# Altium schematic sheet MCU.SchDoc
size A4
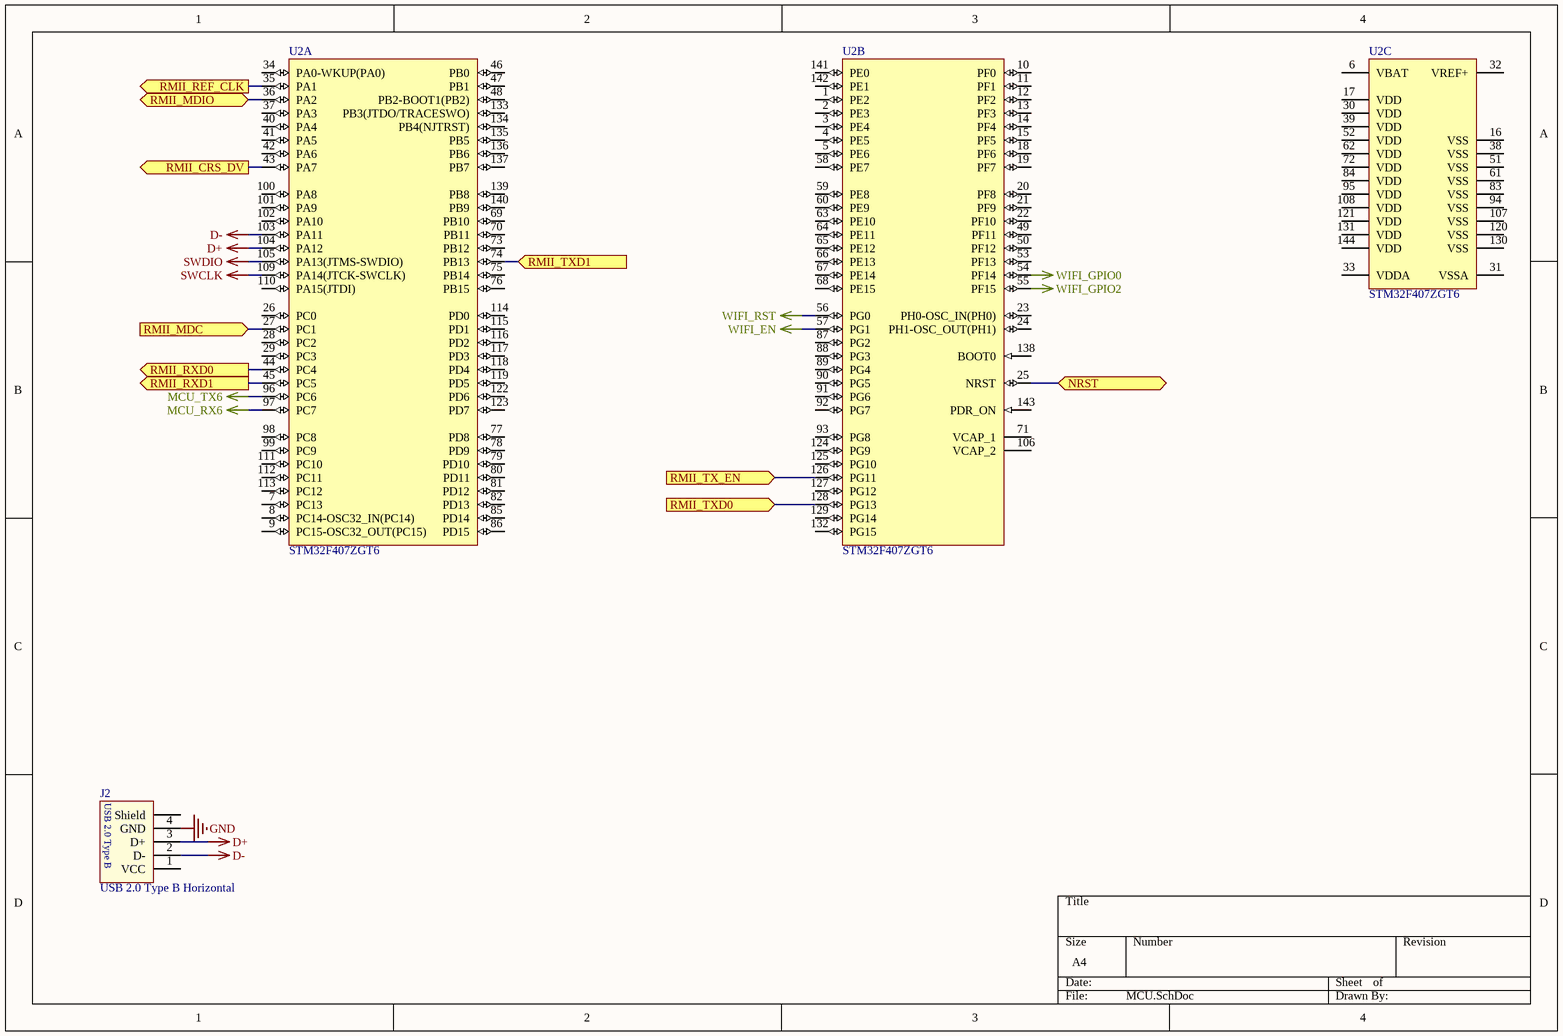
[diagram p0: MCU.SchDoc]

## Parts
J2  USB 2.0 Type B Horizontal  [61400416121]
U2  STM32F407ZGT6  [STM-LQFP144_N]  (parts A,B,C of 3)

## Ports
NRST, RMII_CRS_DV (out), RMII_MDC (in), RMII_MDIO (bidir), RMII_REF_CLK (out), RMII_RXD0 (out), RMII_RXD1 (out), RMII_TX_EN (in), RMII_TXD0 (in), RMII_TXD1 (in)

## Nets
D+: J2.3(D+) U2.104(PA12)
D-: J2.2(D-) U2.103(PA11)
GND: J2.4(GND)
MCU_RX6: U2.97(PC7)
MCU_TX6: U2.96(PC6)
SWCLK: U2.109(PA14(JTCK-SWCLK))
SWDIO: U2.105(PA13(JTMS-SWDIO))
WIFI_EN: U2.57(PG1)
WIFI_GPIO0: U2.54(PF14)
WIFI_GPIO2: U2.55(PF15)
WIFI_RST: U2.56(PG0)
NRST: U2.25(NRST) ; port NRST
RMII_CRS_DV: U2.43(PA7) ; port RMII_CRS_DV
RMII_MDC: U2.27(PC1) ; port RMII_MDC
RMII_MDIO: U2.36(PA2) ; port RMII_MDIO
RMII_REF_CLK: U2.35(PA1) ; port RMII_REF_CLK
RMII_RXD0: U2.44(PC4) ; port RMII_RXD0
RMII_RXD1: U2.45(PC5) ; port RMII_RXD1
RMII_TX_EN: U2.126(PG11) ; port RMII_TX_EN
RMII_TXD0: U2.128(PG13) ; port RMII_TXD0
RMII_TXD1: U2.74(PB13) ; port RMII_TXD1

Not connected (* = marked no-connect by the designer): J2 1(VCC) Shell(Shield); U2 1(PE2) 2(PE3) 3(PE4) 4(PE5) 5(PE6) 6(VBAT) 7(PC13) 8(PC14-OSC32_IN(PC14)) 9(PC15-OSC32_OUT(PC15)) 10(PF0) 11(PF1) 12(PF2) 13(PF3) 14(PF4) 15(PF5) 16(VSS) 17(VDD) 18(PF6) 19(PF7) 20(PF8) 21(PF9) 22(PF10) 23(PH0-OSC_IN(PH0)) 24(PH1-OSC_OUT(PH1)) 26(PC0) 28(PC2) 29(PC3) 30(VDD) 31(VSSA) 32(VREF+) 33(VDDA) 34(PA0-WKUP(PA0)) 37(PA3) 38(VSS) 39(VDD) 40(PA4) 41(PA5) 42(PA6) 46(PB0) 47(PB1) 48(PB2-BOOT1(PB2)) 49(PF11) 50(PF12) 51(VSS) 52(VDD) 53(PF13) 58(PE7) 59(PE8) 60(PE9) 61(VSS) 62(VDD) 63(PE10) 64(PE11) 65(PE12) 66(PE13) 67(PE14) 68(PE15) 69(PB10) 70(PB11) 71(VCAP_1) 72(VDD) 73(PB12) 75(PB14) 76(PB15) 77(PD8) 78(PD9) 79(PD10) 80(PD11) 81(PD12) 82(PD13) 83(VSS) 84(VDD) 85(PD14) 86(PD15) 87(PG2) 88(PG3) 89(PG4) 90(PG5) 91(PG6) 92(PG7) 93(PG8) 94(VSS) 95(VDD) 98(PC8) 99(PC9) 100(PA8) 101(PA9) 102(PA10) 106(VCAP_2) 107(VSS) 108(VDD) 110(PA15(JTDI)) 111(PC10) 112(PC11) 113(PC12) 114(PD0) 115(PD1) 116(PD2) 117(PD3) 118(PD4) 119(PD5) 120(VSS) 121(VDD) 122(PD6) 123(PD7) 124(PG9) 125(PG10) 127(PG12) 129(PG14) 130(VSS) 131(VDD) 132(PG15) 133(PB3(JTDO/TRACESWO)) 134(PB4(NJTRST)) 135(PB5) 136(PB6) 137(PB7) 138(BOOT0) 139(PB8) 140(PB9) 141(PE0) 142(PE1) 143(PDR_ON) 144(VDD)

## Notes on the sheet
- (in symbol USB 2.0 Type B Horizontal) USB 2.0 Type B

## Library data of the parts
J2 = USB 2.0 Type B Horizontal: USB 2.0 Type B Horizontal WR-COM; Interface Type: Type B; Sub-Family: USB 2.0; Gender: Receptacle; ComponentLink1Description: Manufacturer; ComponentLink1URL: http://www.we-online.de; ComponentLink2Description: Datasheet; ComponentLink2URL: http://katalog.we-online.de/em/datasheet/61400416121.pdf; Part Number: 61400416121; Published Date: April 2017; Publisher: Wurth Elektronik; Type: Horizontal; Construction: THT
U2 = STM32F407ZGT6: ARM Cortex-M4 32-bit MCU+FPU, 210 DMIPS, 1024 kB Flash, 192 kB Internal RAM, 114 I/Os, 144-pin LQFP, -40 to 85 degC, Tray; Manufacturer: STMicroelectronics; D/A Converter: 2x12-bit; FLASH Size (Prog) (kB): 1024; I/Os (High Current): 114; Internal RAM Size (kB): 192; Operating Frequency(F) (Processor speed) (MHz): 168; Supply Voltage(Vcc) max (V): 3.6; Supply Voltage(Vcc) min (V): 1.8; DatasheetVersion: Rev. 4; PackageVersion: Rev. 4, 06/2013; PackageReference: LQFP144; PackageDescription: 144-Pin Low Profile Quad Flat Package, 20 x 20 mm Body, 0.5 mm Pitch; Supplier 1: Digi-Key; Supplier Part Number 1: 497-11766-ND; Supplier 2: Newark; Supplier Part Number 2: 73T2334; Supplier 3: Mouser; Supplier Part Number 3: 511-STM32F407ZGT6; Core: ARM Cortex-M4; Packing: Tray; Mounting Technology: Surface Mount; PartNumber: STM32F407ZGT6; ComponentLink1Description: Manufacturer URL; ComponentLink1URL: http://www.st.com/web/en/home.html; ComponentLink2Description: Datasheet; ComponentLink2URL: http://www.st.com/st-web-ui/static/active/en/resource/technical/document/datasheet/DM00037051.pdf; ComponentLink3Description: Package Specification; ComponentLink3URL: http://www.st.com/st-web-ui/static/active/en/resource/technical/document/datasheet/DM00037051.pdf